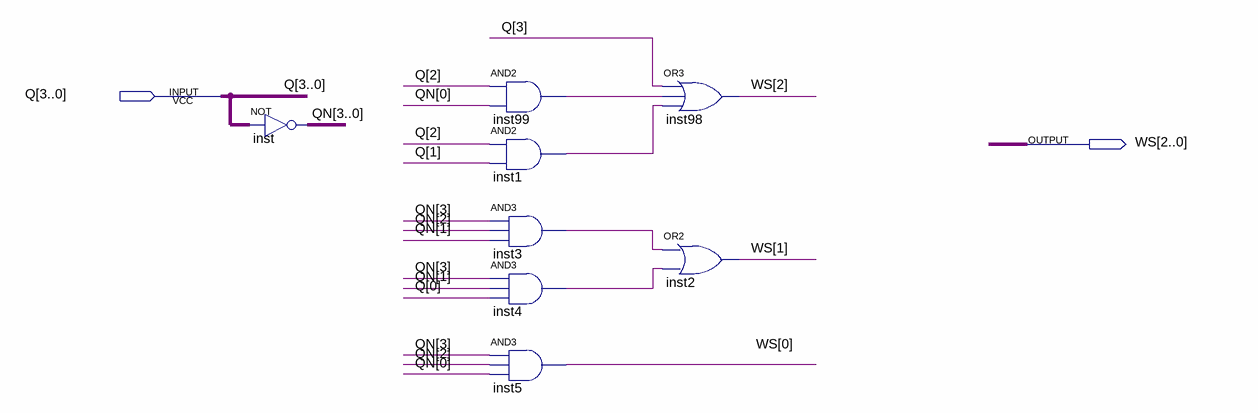
[diagram p0: schematic sheet]
// Quartus schematic WS.bdf as structural Verilog: 8 symbols, 2 pins
module WS (
  input  [3:0] Q,
  output [2:0] WS
);

  wire inst1_out, inst3_out, inst4_out, inst99_out;
  wire [3:0] QN;

  assign QN = ~Q;  // NOT inst, 4 bits wide
  and inst99 (inst99_out, Q[2], QN[0]);
  and inst1 (inst1_out, Q[2], Q[1]);
  and inst3 (inst3_out, QN[3], QN[2], QN[1]);
  and inst4 (inst4_out, QN[3], QN[1], Q[0]);
  and inst5 (WS[0], QN[3], QN[2], QN[0]);
  or inst98 (WS[2], Q[3], inst99_out, inst1_out);
  or inst2 (WS[1], inst3_out, inst4_out);
endmodule
